# EAGLE design uUSB breakout v2 (EAGLE 7.3.0)
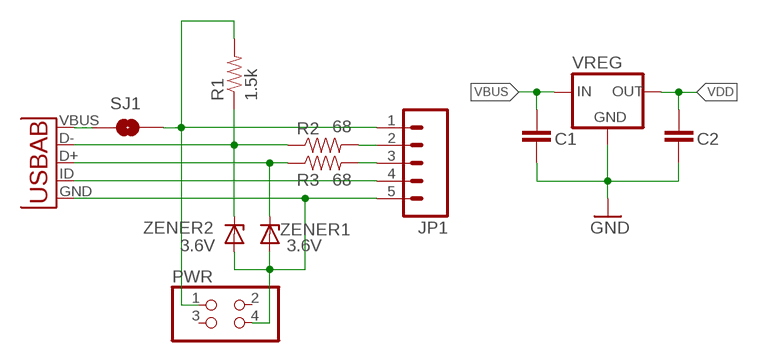
[diagram p0: schematic, sheet 1]

## Parts
C1  CAPACITOR_NPOL-0805  [C805]
C2  CAPACITOR_NPOL-0805  [C805]
JP1  M05PTH  [1X05]
PWR  PINHD-2X2  [2X02]
R1  1.5k  RESISTOR0805-RES  [0805]
R2  68  RESISTOR0805-RES  [0805]
R3  68  RESISTOR0805-RES  [0805]
SJ1  SOLDERJUMPERNO  [SJ_2S-NO]
UUSB  USB-AB  [USB-AB-MICRO-SMD]
VREG  V_REG_MIC2920  [SOT223]
ZENER1  3.6V  ZENER-DIODESOD80C  [SOD80C]
ZENER2  3.6V  ZENER-DIODESOD80C  [SOD80C]

## Nets
D-: R1.1 R2.1 UUSB.D- ZENER2.C
GND: C1.2 C2.2 JP1.5 PWR.4 UUSB.GND VREG.2(GND) VREG.4(GND) ZENER1.A ZENER2.A
ID: JP1.4 UUSB.ID(USBID)
N$1: JP1.2 R2.2
N$2: JP1.3 R3.2
N$3: R3.1 UUSB.D+ ZENER1.C
VBUS: C1.1 SJ1.1 UUSB.VBUS VREG.1(IN)
VDD: C2.1 JP1.1 PWR.1 R1.2 SJ1.2 VREG.3(OUT)
Unconnected: PWR.2 PWR.3

## Library data of the parts
C1 C2 = dp_devices:CAPACITOR_NPOL: Non-Polarized capacitor in various packages
JP1 = SparkFun-Connectors:M05: Header 5 Standard 5-pin 0.1" header. Use with straight break away headers (SKU : PRT-00116), right angle break away headers (PRT-00553), swiss pins (PRT-00743), machine pins (PRT-00117), and female headers (PRT-00115). Molex polarized connector foot print use with SKU : PRT-08230 with associated crimp pins and housings.
PWR = pinhead:PINHD-2X2: PIN HEADER
R1-R3 = SparkFun-Passives:RESISTOR: Resistor Basic schematic elements and footprints for 0603, 1206, and PTH resistors.
SJ1 = SparkFun-Retired:SOLDERJUMPER: Solder Jumper Standard SMD solder jumper. Used to automate production. Two varients : Normally Open and Normally Closed are the same, but have different paste layers. NC will have a large amount of paste and should jumper during reflow.
UUSB = SparkFun-Connectors:USB-AB: This is a USB AB connector that is compatible with USB OTG. i.e. this connector can serve as a host or device
VREG = SparkFun-PowerIC:V_REG_MIC2920: MIC2920A (http://www.micrel.com/_PDF/mic2920.pdf) - 400mA output LDO Regulator
ZENER1 ZENER2 = diode:ZENER-DIODE: Z-Diode

## Board
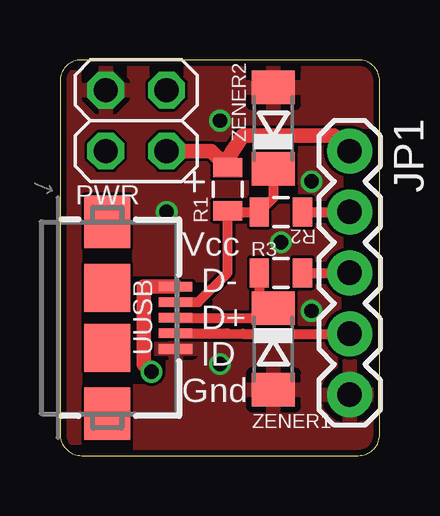
[diagram p1: board, top side]
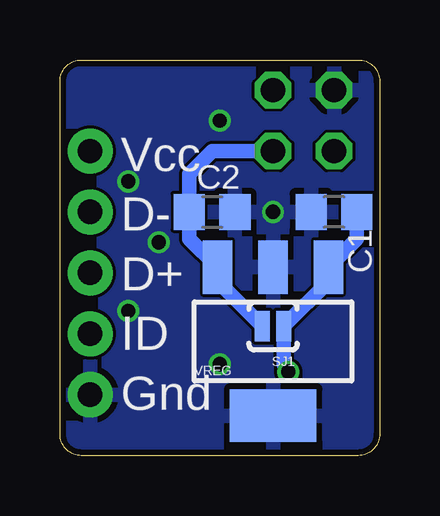
[diagram p2: board, bottom side, seen from below]

Size 13.32 x 16.5 mm. Coordinates in mm from the lower left corner, seen from the top.
Outline: 13.32,0.89 13.32,15.62 arc90 12.44,16.5 0.89,16.5 arc90 0,15.61 0,0.9 arc90 0.9,0 12.43,0 arc90 13.32,0.89
Copper layers (1*16): Top 0.035mm / dielectric 1.5mm / Bottom 0.035mm
Design rules "dirt_cheap_dirty_boards.v1": minimum track width 5mil, minimum drill 12mil, track to track 5mil, track to pad 5mil, pad to pad 5mil, via to via 5mil, smd to smd 0mil, copper to edge 10mil, drill to drill 10mil, minimum pad ring 10mil, minimum via ring 6mil, stop-mask expansion 2mil, vias tented up to drill 25mil, thermal gap 10mil

### Footprints (pad centres in the part's own frame; a part is rotated, then mirrored left to right if it is on the bottom)
C805 = smd 1.3 x 1.5: 1 -0.95,0; 2 0.95,0
1X05 = drill 1.016 pad 1.88: 1 0,0; 2 2.54,0; 3 5.08,0; 4 7.62,0; 5 10.16,0
2X02 = drill 1.016 octagon: 1 -1.27,-1.27; 2 -1.27,1.27; 3 1.27,-1.27; 4 1.27,1.27
0805 = smd 0.8 x 1.2: 1 -0.9,0; 2 0.9,0
SJ_2S-NO = smd 0.635 x 1.27: 1 -0.45,0; 2 0.45,0
USB-AB-MICRO-SMD = smd 1.4 x 0.4: D+ 2.85,0; D- 2.85,0.65; GND 2.85,-1.3; ID 2.85,-0.65; VBUS 2.85,1.3 | smd 1.9 x 2: P$6 0,1.25; P$7 0,-1.25 | smd 1.9 x 2.2: P$8 0,4; P$9 0,-4
SOT223 = smd 1.219 x 2.235: 1 -2.311,-3.099; 2 0,-3.099; 3 2.311,-3.099 | smd 3.6 x 2.2: 4 0,3.099
SOD80C = smd 1.4 x 1.8: A 1.7,0; C -1.7,0

### Placement (x,y rotation side)
C1  1.91,10.16 180 bottom
C2  6.99,10.16 0 bottom
JP1  12.06,12.7 270 top
PWR  3.17,13.97 90 top
R1  6.99,11.11 90 top
R2  9.21,10.16 0 top
R3  9.21,7.62 0 top
SJ1  4.45,5.4 180 bottom
UUSB  1.97,5.75 0 top
VREG  4.45,4.76 180 bottom
ZENER1  8.89,4.45 270 top
ZENER2  8.89,13.65 90 top

### Tracks (layer width: path | path; a pad name or v marks a point on that pad's centre or on a via)
D-
  Top 0.406: UUSB.D- 5.76,6.4 6.99,7.62 R1.1 6.72,10.16 R2.1 8.89,10.74 ZENER2.C
GND  (via drill 0.6)
  other vias: 10.48,6.03 9.21,8.89 6.67,3.81 4.45,10.16 10.48,11.43 6.67,13.97
  pour Top: 0,16.51 0,0 13.34,0 13.34,16.51
  pour Bottom: 0,16.51 0,0 13.34,0 13.34,16.51
ID
  Top 0.406: UUSB.ID 6.97,5.1 7.62,5.08 JP1.4
N$1
  Top 0.406: R2.2 JP1.2
N$2
  Top 0.406: R3.2 JP1.3
N$3
  Top 0.406: UUSB.D+ 8.49,5.75 ZENER1.C 8.31,6.73 R3.1
VBUS  (via drill 0.6)
  Top 0.61: UUSB.VBUS 3.49,7.05 3.49,3.81 v3.81,3.49
  Bottom 0.61: C1.1 0.95,9.04 VREG.1 2.13,7.26 SJ1.1 4,3.81 v3.81,3.49
VDD
  Top 0.61: JP1.1 11.43,13.34 7.62,13.34 6.99,12.38 R1.2 6.3,12.7 PWR.1
  Bottom 0.61: SJ1.2 6.76,7.26 VREG.3 7.93,9.04 C2.1 7.93,11.75 6.99,12.7 PWR.1

### Text on the board
tNames: + | Vcc / D- / D+ / ID / Gnd
bNames: Vcc / D- / D+ / ID / Gnd